# Altium schematic sheet SmartCar_Groop7_alter.SchDoc
size A4
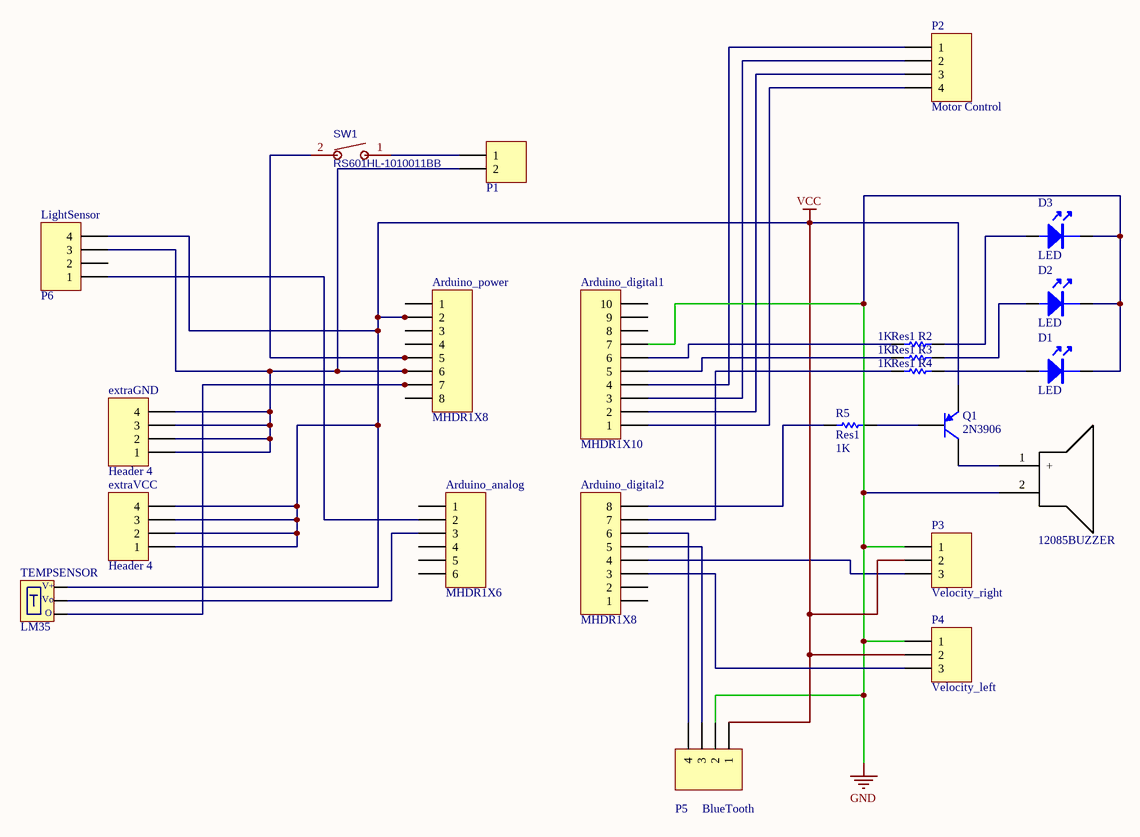
[diagram p0: SmartCar_Groop7_alter.SchDoc]

## Parts
?  12085BUZZER  [BUZ-TH_BD12.0-P6.50-D0.6_SEA-1285F]
Arduino_analog  MHDR1X6  [SIP-6]
Arduino_digital1  MHDR1X10  [SIP-10]
Arduino_digital2  MHDR1X8  [SIP-8]
Arduino_power  MHDR1X8  [SIP-8]
D1  LED  [LEDLXH-3]
D2  LED  [LEDLXH-3]
D3  LED  [LEDLXH-3]
extraGND  Header 4  [HDR1X4]
extraVCC  Header 4  [HDR1X4]
P1  Header 2  [HDR2X1_A]  (value not drawn)
P2  Motor Control  [HDR4X1_A]
P3  Velocity_right  [HDR3X1_A]
P4  Velocity_left  [HDR3X1_A]
P5  BlueTooth  [HDR4X1_A]
P6  LightSensor  [HDR4X1_A]
Q1  2N3906  [PNP]
R2  Res1  value 1K  [AXIAL-0.3]
R3  Res1  value 1K  [AXIAL-0.3]
R4  Res1  value 1K  [AXIAL-0.3]
R5  Res1  value 1K  [AXIAL-0.3]
SW1  RS601HL-1010011BB  [SW-TH_RS601HL-1010011BB]
TEMPSENSOR  LM35  [LM35]

## Nets
GND: ?.2 Arduino_digital1.7 D1.2 D2.2 D3.2 P3.1 P4.1 P5.2
VCC: Arduino_power.2 extraVCC.1 extraVCC.2 extraVCC.3 extraVCC.4 P3.2 P4.2 P5.1 P6.4 Q1.1(E) TEMPSENSOR.1
Net?_1: ?.1(+) Q1.3(C)
NetArduino_analog_2: Arduino_analog.2 P6.1
NetArduino_analog_3: Arduino_analog.3 TEMPSENSOR.2
NetArduino_digital1_1: Arduino_digital1.1 P2.4
NetArduino_digital1_2: Arduino_digital1.2 P2.3
NetArduino_digital1_3: Arduino_digital1.3 P2.2
NetArduino_digital1_4: Arduino_digital1.4 P2.1
NetArduino_digital1_5: Arduino_digital1.5 R3.2
NetArduino_digital1_6: Arduino_digital1.6 R2.2
NetArduino_digital2_3: Arduino_digital2.3 P4.3
NetArduino_digital2_4: Arduino_digital2.4 P3.3
NetArduino_digital2_5: Arduino_digital2.5 P5.3
NetArduino_digital2_6: Arduino_digital2.6 P5.4
NetArduino_digital2_7: Arduino_digital2.7 R4.2
NetArduino_digital2_8: Arduino_digital2.8 R5.2
NetArduino_power_5: Arduino_power.5 SW1.2
NetArduino_power_6: Arduino_power.6 extraGND.1 extraGND.2 extraGND.3 extraGND.4 P1.2 P6.3
NetArduino_power_7: Arduino_power.7 TEMPSENSOR.3
NetD1_1: D1.1 R4.1
NetD2_1: D2.1 R3.1
NetD3_1: D3.1 R2.1
NetP1_1: P1.1 SW1.1
NetQ1_2: Q1.2(B) R5.1

Not connected (* = marked no-connect by the designer): Arduino_analog 1 4 5 6; Arduino_digital1 8 9 10; Arduino_digital2 1 2; Arduino_power 1 3 4 8; P6 2

## Notes on the sheet
- (in symbol LM35) V+; Vo; O

## Library data of the parts
? = 12085BUZZER: 12mm*8.5mmBUZZER
Arduino_analog = MHDR1X6: Header, 6-Pin; LatestRevisionDate: 17-Jul-2002; LatestRevisionNote: Re-released for DXP Platform.; Publisher: Altium Limited
Arduino_digital1 = MHDR1X10: Header, 10-Pin; LatestRevisionDate: 17-Jul-2002; LatestRevisionNote: Re-released for DXP Platform.; Publisher: Altium Limited
Arduino_digital2 Arduino_power = MHDR1X8: Header, 8-Pin; LatestRevisionDate: 17-Jul-2002; LatestRevisionNote: Re-released for DXP Platform.; Publisher: Altium Limited
extraGND extraVCC = Header 4: Header, 4-Pin; LatestRevisionDate: 17-Jul-2002; LatestRevisionNote: Re-released for DXP Platform.; Publisher: Altium Limited
P1 = Header 2: 接插件; LatestRevisionDate: 17-Jul-2002; LatestRevisionNote: Re-released for DXP Platform.; Publisher: Altium Limited
P2 P5 P6 = Header 4: 接插件; LatestRevisionDate: 17-Jul-2002; LatestRevisionNote: Re-released for DXP Platform.; Publisher: Altium Limited
P3 P4 = Header 3: 接插件; LatestRevisionDate: 17-Jul-2002; LatestRevisionNote: Re-released for DXP Platform.; Publisher: Altium Limited
Q1 = 2N3906: PNP General Purpose Amplifier; Published: 8-Jun-2000; LatestRevisionDate: 15-Jan-2003; LatestRevisionNote: PCB Footprint 'BCY-W3/D4.7' replaced; DatasheetDocument: 1997; PackageDocument: Sep-1998; PackageReference: TO-92A; Publisher: Altium Limited; Code_JEDEC: TO-92A; ComponentLink1Description: Manufacturer Link; ComponentLink1URL: http://www.fairchildsemi.com/; ComponentLink2Description: Datasheet; ComponentLink2URL: http://www.fairchildsemi.com/ds/2N%2F2N3906.pdf
R2-R5 = Res1: Resistor; Published: 8-Jun-2000; LatestRevisionDate: 17-Jul-2002; LatestRevisionNote: Re-released for DXP Platform.; PackageReference: AXIAL-0.3; Publisher: Altium Limited
SW1 = RS601HL-1010011BB: BOM_Manufacturer: HCTL(华灿天禄); Contributor: lcsc; BOM_Supplier: LCSC; BOM_Supplier Part: C2885782; BOM_Manufacturer Part: RS601HL-1010011BB; link: https://atta.szlcsc.com/upload/public/pdf/source/20210820/B1970E40D09304D7FA648AE2099FB3E8.pdf; BOM_JLCPCB Part Class: Extended Part; spicePre: S; spiceSymbolName: RS601HL-1010011BB
TEMPSENSOR = LM35: LM35温度传感器